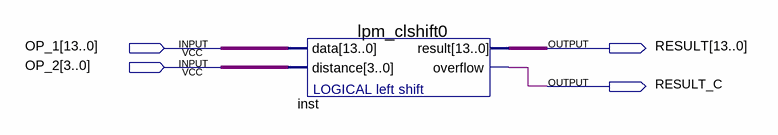
[diagram p0: schematic sheet]
// Quartus schematic OP_SLA.bdf as structural Verilog: 1 symbols, 4 pins
module OP_SLA (
  input  [13:0] OP_1,
  input  [3:0] OP_2,
  output [13:0] RESULT,
  output RESULT_C
);

  lpm_clshift0 inst (.data(OP_1), .distance(OP_2), .result(RESULT), .overflow(RESULT_C));
endmodule
